# Altium project RasPiHAT-INPUT.PrjPcb
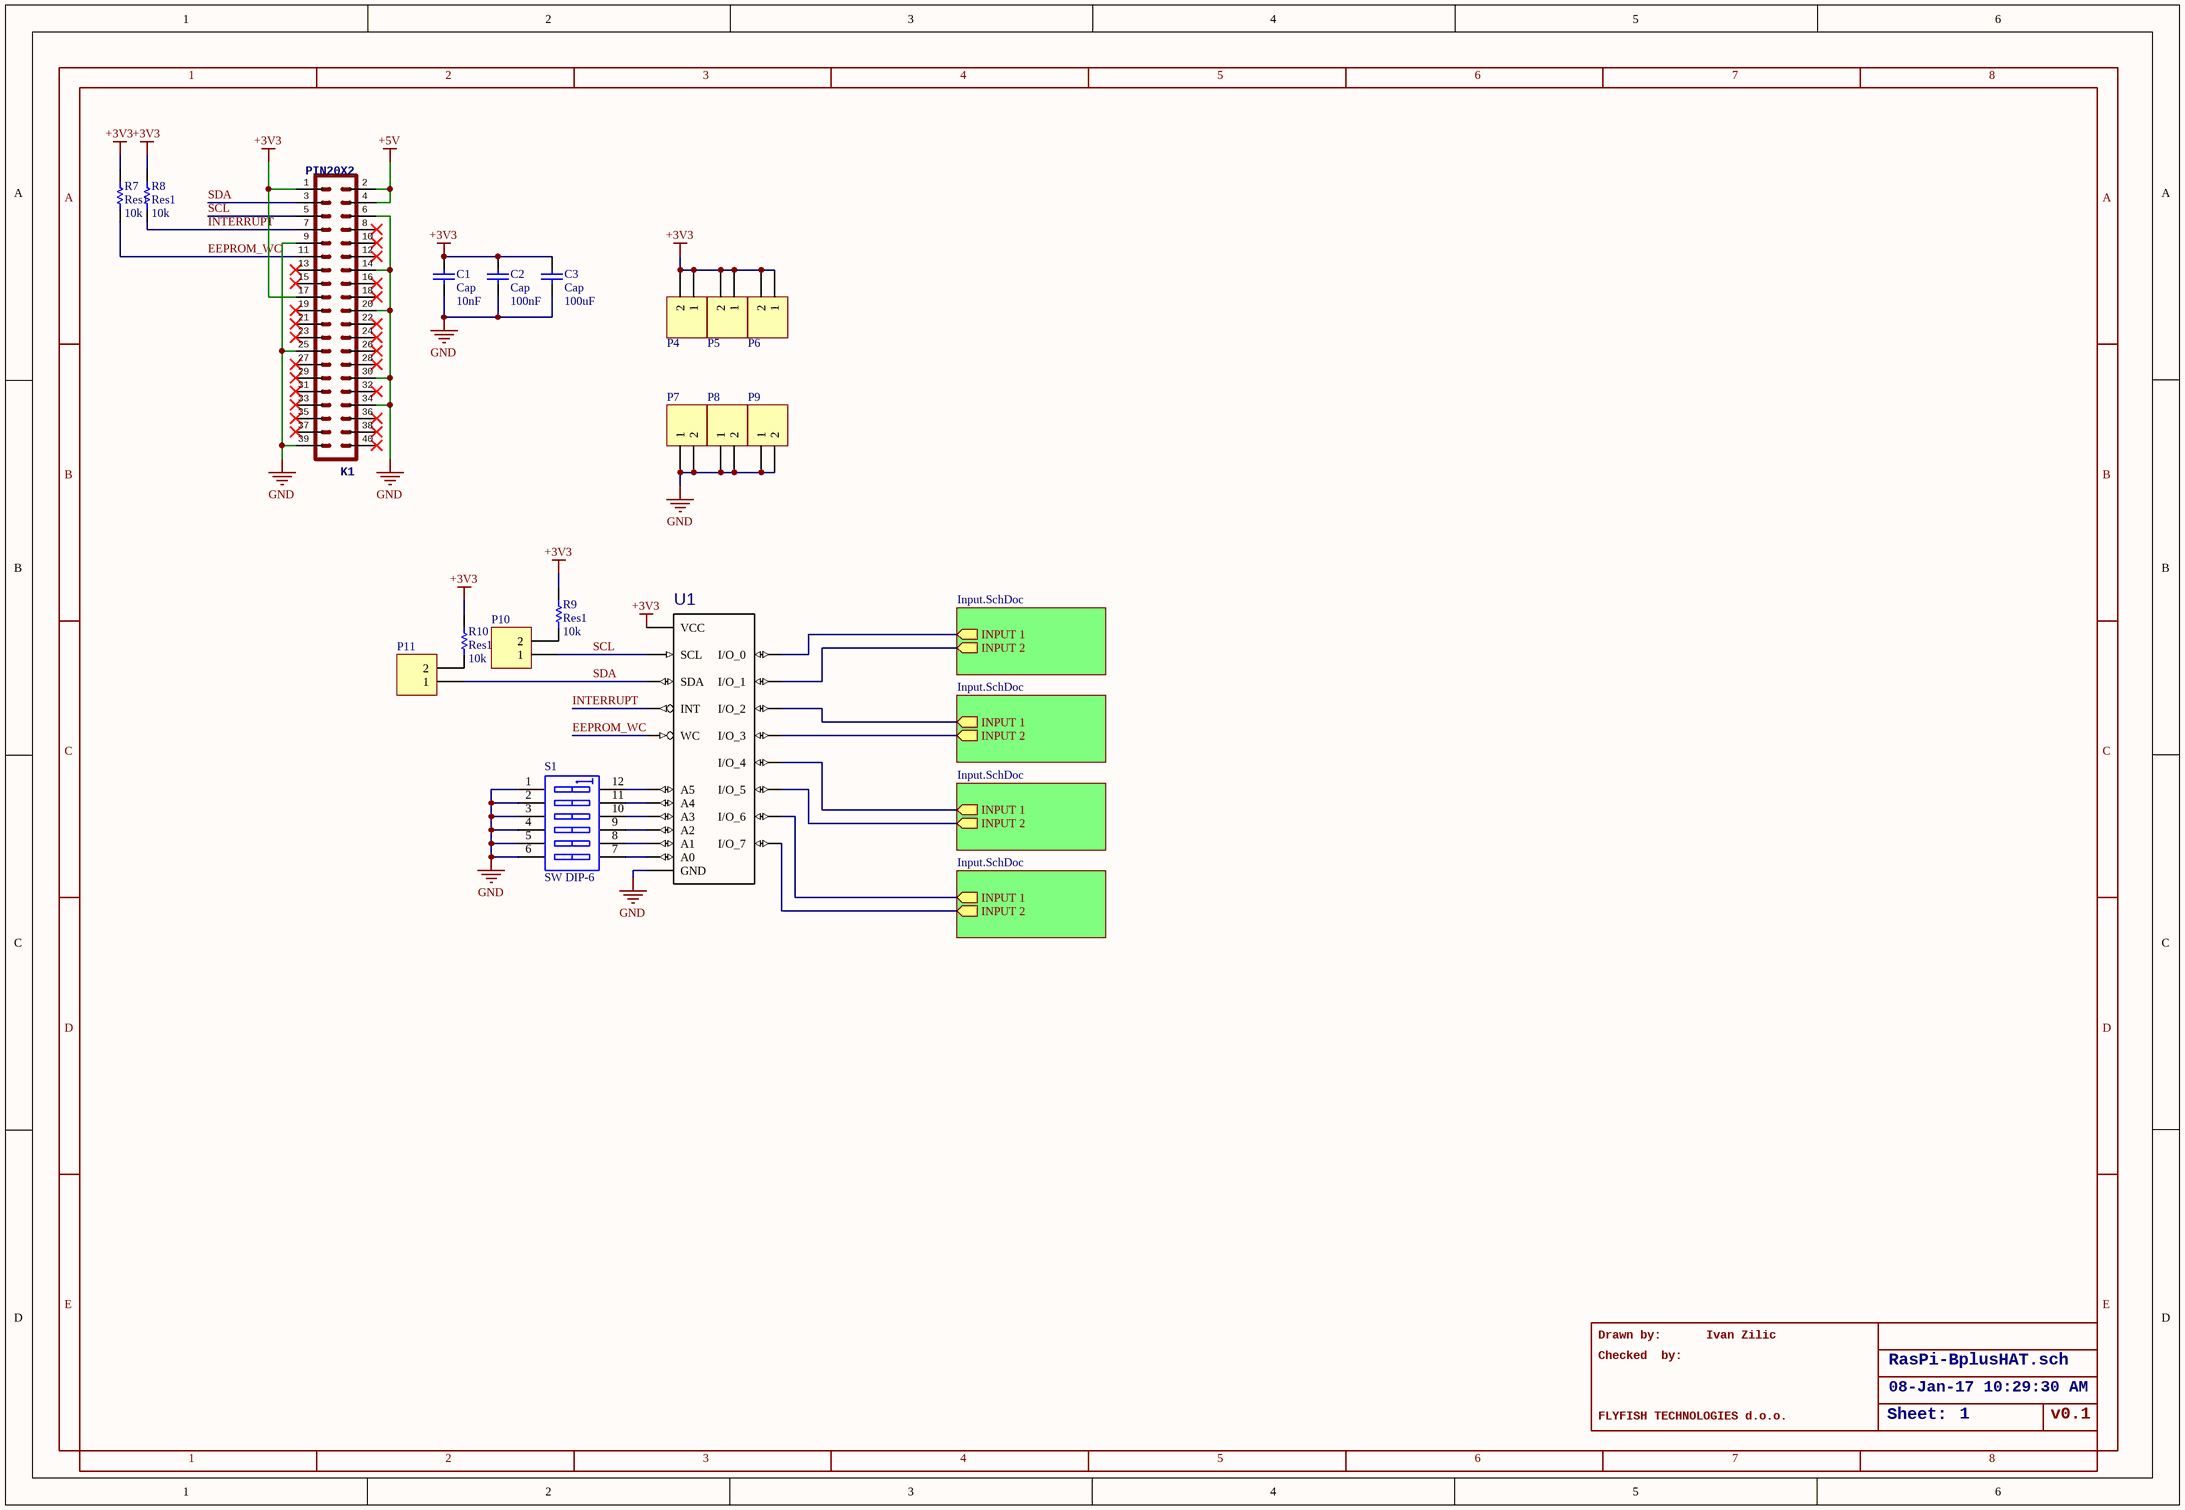
[diagram p0: RasPiHAT-INPUT.SchDoc]
2 sheets, 54 parts. Net scope: hierarchical (ports join the sheet entries above them; power ports are global).
Board file: RasPiHAT-INPUT.PcbDoc
Sheets:
  RasPiHAT-INPUT.SchDoc
    RM = Input.SchDoc
    RM = Input.SchDoc
    RM = Input.SchDoc
    RM = Input.SchDoc

## Sheet RasPiHAT-INPUT.SchDoc
size 409 x 282 mm; >DRAWING_NAME: RasPi-BplusHAT.sch; >LAST_DATE_TIME: 08-Jan-17 10:29:30 AM; >SHEET: 1; Sheet:: Sheet:

### Parts
C1  Cap  value 10nF  [6-0805_N]
C2  Cap  value 100nF  [6-0805_N]
C3  Cap  value 100uF  [6-0805_N]
K1  >NAME: K1  [HDR2X20]  (hidden comment: PIN20X2)
P4  Header 2  [2 PIN TERM BLK]  (value not drawn)
P5  Header 2  [2 PIN TERM BLK]  (value not drawn)
P6  Header 2  [2 PIN TERM BLK]  (value not drawn)
P7  Header 2  [2 PIN TERM BLK]  (value not drawn)
P8  Header 2  [2 PIN TERM BLK]  (value not drawn)
P9  Header 2  [2 PIN TERM BLK]  (value not drawn)
P10  Header 2  [HDR1X2]  (value not drawn)
P11  Header 2  [HDR1X2]  (value not drawn)
R7  Res1  value 10k  [6-0805_N]
R8  Res1  value 10k  [6-0805_N]
R9  Res1  value 10k  [6-0805_N]
R10  Res1  value 10k  [6-0805_N]
S1  SW DIP-6  [DIP-12/SW]
U1  PCA9501  [TSSOP20]  (value not drawn)

### Sub-sheets
RM = Input.SchDoc: INPUT 1 (out), INPUT 2 (out)
RM = Input.SchDoc: INPUT 1 (out), INPUT 2 (out)
RM = Input.SchDoc: INPUT 1 (out), INPUT 2 (out)
RM = Input.SchDoc: INPUT 1 (out), INPUT 2 (out)

### Nets
+3V3: C1.2 C2.2 C3.2 K1.1 K1.17 P4.1 P4.2 P5.1 P5.2 P6.1 P6.2 R7.1 R8.1 R9.1 R10.1 U1.20(VCC)
+5V: K1.2 K1.4
GND: C1.1 C2.1 C3.1 K1.6 K1.9 K1.14 K1.20 K1.25 K1.30 K1.34 K1.39 P7.1 P7.2 P8.1 P8.2 P9.1 P9.2 S1.1(A1) S1.2(A2) S1.3(A3) S1.4(A4) S1.5(A5) S1.6(A6) U1.10(GND)
EEPROM_WC: K1.11 R7.2 U1.17(WC)
INTERRUPT: K1.7 R8.2 U1.8(INT)
SCL: K1.5 P10.1 U1.18(SCL)
SDA: K1.3 P11.1 U1.19(SDA)
NetP10_2: P10.2 R9.2
NetP11_2: P11.2 R10.2
NetR1_RM1_1: U1.16(I/O_7) ; sheet RM/INPUT 2
NetR1_RM2_1: U1.14(I/O_5) ; sheet RM/INPUT 2
NetR1_RM3_1: U1.7(I/O_3) ; sheet RM/INPUT 2
NetR1_RM4_1: U1.5(I/O_1) ; sheet RM/INPUT 2
NetR4_RM1_1: U1.15(I/O_6) ; sheet RM/INPUT 1
NetR4_RM2_1: U1.13(I/O_4) ; sheet RM/INPUT 1
NetR4_RM3_1: U1.6(I/O_2) ; sheet RM/INPUT 1
NetR4_RM4_1: U1.4(I/O_0) ; sheet RM/INPUT 1
NetS1_7: S1.7(B6) U1.1(A0)
NetS1_8: S1.8(B5) U1.2(A1)
NetS1_9: S1.9(B4) U1.3(A2)
NetS1_10: S1.10(B3) U1.12(A3)
NetS1_11: S1.11(B2) U1.11(A4)
NetS1_12: S1.12(B1) U1.9(A5)

Not connected (* = marked no-connect by the designer): K1 8* 10* 12* 13* 15* 16* 18* 19* 21* 22* 23* 24* 26* 27* 28* 29* 31* 32* 33* 35* 36* 37* 38* 40*

### Notes on the sheet
- Drawn by:
- Checked  by:
- Ivan Zilic
- FLYFISH TECHNOLOGIES d.o.o.
- v0.1
- 1
- 2
- 3
- 4
- 5
- 6
- 7
- 8
- A
- B
- C
- D
- E

### Library data of the parts
C1-C3 = Cap: Capacitor; Published: 8-Jun-2000; LatestRevisionDate: 17-Jul-2002; LatestRevisionNote: Re-released for DXP Platform.; PackageReference: RAD-0.3; Publisher: Altium Limited; PackageDescription: Radial Cap, Thru-Hole; 2 Leads; 0.3 in Pin Spacing
P4-P11 = Header 2: Header, 2-Pin; LatestRevisionDate: 17-Jul-2002; LatestRevisionNote: Re-released for DXP Platform.; Publisher: Altium Limited
R7-R10 = Res1: Resistor; Published: 8-Jun-2000; LatestRevisionDate: 17-Jul-2002; LatestRevisionNote: Re-released for DXP Platform.; PackageReference: AXIAL-0.3; Publisher: Altium Limited; PackageDescription: Axial Device, Thru-Hole; 2 Leads; 0.3 in Pin Spacing
S1 = SW DIP-6: DIP Switch, 6 Position, SPST; Published: 24-Mar-1999; LatestRevisionDate: 17-Jul-2002; LatestRevisionNote: Re-released for DXP Platform.; PackageReference: DIP-12/SW; Publisher: Altium Limited; PackageDescription: DIP Switch; 12 Leads
U1 = PCA9501: MF: NXP Semiconductors; MP: PCA9501; Package: None; Availability: Unavailable; Price: None; Value: *
K1 = PIN20X2: >VALUE: PIN20X2

## Sheet Input.SchDoc
size A4
Used 4 times, as channels RM, RM, RM, RM. Parts and nets are listed once, with the designators drawn on the sheet.
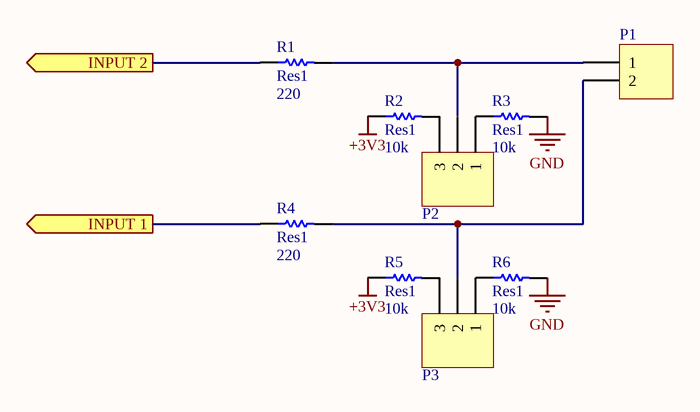
[diagram p1: Input.SchDoc]

### Parts
P1  Header 2  [2 PIN TERM BLK]  (value not drawn)
P2  Header 3  [HDR1X3]  (value not drawn)
P3  Header 3  [HDR1X3]  (value not drawn)
R1  Res1  value 220  [6-0805_N]
R2  Res1  value 10k  [6-0805_N]
R3  Res1  value 10k  [6-0805_N]
R4  Res1  value 220  [6-0805_N]
R5  Res1  value 10k  [6-0805_N]
R6  Res1  value 10k  [6-0805_N]

### Ports
INPUT 1 (out), INPUT 2 (out)

### Nets
+3V3: R2.1 R5.1
GND: R3.2 R6.2
INPUT 1: R4.1 ; port INPUT 1
INPUT 2: R1.1 ; port INPUT 2
NetP1_1: P1.1 P2.2 R1.2
NetP1_2: P1.2 P3.2 R4.2
NetP2_1: P2.1 R3.1
NetP2_3: P2.3 R2.2
NetP3_1: P3.1 R6.1
NetP3_3: P3.3 R5.2

### Channels
RM: designators P1=P1_RM#1 P2=P2_RM#1 P3=P3_RM4 R1=R1_RM4 R2=R2_RM4 R3=R3_RM4 R4=R4_RM4 R5=R5_RM4 R6=R6_RM4; ports INPUT 1=NetR4_RM4_1 INPUT 2=NetR1_RM4_1
RM: designators P1=P1_RM#2 P2=P2_RM#2 P3=P3_RM3 R1=R1_RM3 R2=R2_RM3 R3=R3_RM3 R4=R4_RM3 R5=R5_RM3 R6=R6_RM3; ports INPUT 1=NetR4_RM3_1 INPUT 2=NetR1_RM3_1
RM: designators P1=P1_RM#3 P2=P2_RM#3 P3=P3_RM2 R1=R1_RM2 R2=R2_RM2 R3=R3_RM2 R4=R4_RM2 R5=R5_RM2 R6=R6_RM2; ports INPUT 1=NetR4_RM2_1 INPUT 2=NetR1_RM2_1
RM: designators P1=P1_RM#4 P2=P2_RM#4 P3=P3_RM1 R1=R1_RM1 R2=R2_RM1 R3=R3_RM1 R4=R4_RM1 R5=R5_RM1 R6=R6_RM1; ports INPUT 1=NetR4_RM1_1 INPUT 2=NetR1_RM1_1

### Library data of the parts
P1 = Header 2: Header, 2-Pin; LatestRevisionDate: 17-Jul-2002; LatestRevisionNote: Re-released for DXP Platform.; Publisher: Altium Limited
P2 P3 = Header 3: Header, 3-Pin; LatestRevisionDate: 17-Jul-2002; LatestRevisionNote: Re-released for DXP Platform.; Publisher: Altium Limited
R1-R6 = Res1: Resistor; Published: 8-Jun-2000; LatestRevisionDate: 17-Jul-2002; LatestRevisionNote: Re-released for DXP Platform.; PackageReference: AXIAL-0.3; Publisher: Altium Limited; PackageDescription: Axial Device, Thru-Hole; 2 Leads; 0.3 in Pin Spacing

## Nets that join several sheets
+3V3: RasPiHAT-INPUT (16 pins), RM (R2_RM4.1 R5_RM4.1), RM (R2_RM3.1 R5_RM3.1), RM (R2_RM2.1 R5_RM2.1), RM (R2_RM1.1 R5_RM1.1)
GND: RasPiHAT-INPUT (24 pins), RM (R3_RM4.2 R6_RM4.2), RM (R3_RM3.2 R6_RM3.2), RM (R3_RM2.2 R6_RM2.2), RM (R3_RM1.2 R6_RM1.2)
NetR1_RM1_1: RasPiHAT-INPUT (U1.16), RM (R1_RM1.1)
NetR1_RM2_1: RasPiHAT-INPUT (U1.14), RM (R1_RM2.1)
NetR1_RM3_1: RasPiHAT-INPUT (U1.7), RM (R1_RM3.1)
NetR1_RM4_1: RasPiHAT-INPUT (U1.5), RM (R1_RM4.1)
NetR4_RM1_1: RasPiHAT-INPUT (U1.15), RM (R4_RM1.1)
NetR4_RM2_1: RasPiHAT-INPUT (U1.13), RM (R4_RM2.1)
NetR4_RM3_1: RasPiHAT-INPUT (U1.6), RM (R4_RM3.1)
NetR4_RM4_1: RasPiHAT-INPUT (U1.4), RM (R4_RM4.1)